# Altium schematic sheet DAC_OUT.SchDoc
size A3; Date: 2015/11/20; CompanyName: 成都淞幸科技有限责任公司; DrawnBy: 冯光荣; Engineer: 冯光荣; Organization: 系统集成部; Address1: 四川省成都市西航港街道珠江路; Address2: 空港国际城7栋1单元11层; DocumentNumber: SX-ZNJJ-02; Revision: v3.1; SheetNumber: 6; SheetTotal: 6; Telphone: 028-6445 2893; Fax: 028-8580 5757; Website: www.sunsheen.cn; DocumentName: DocumentName; ProjectName: ProjectName
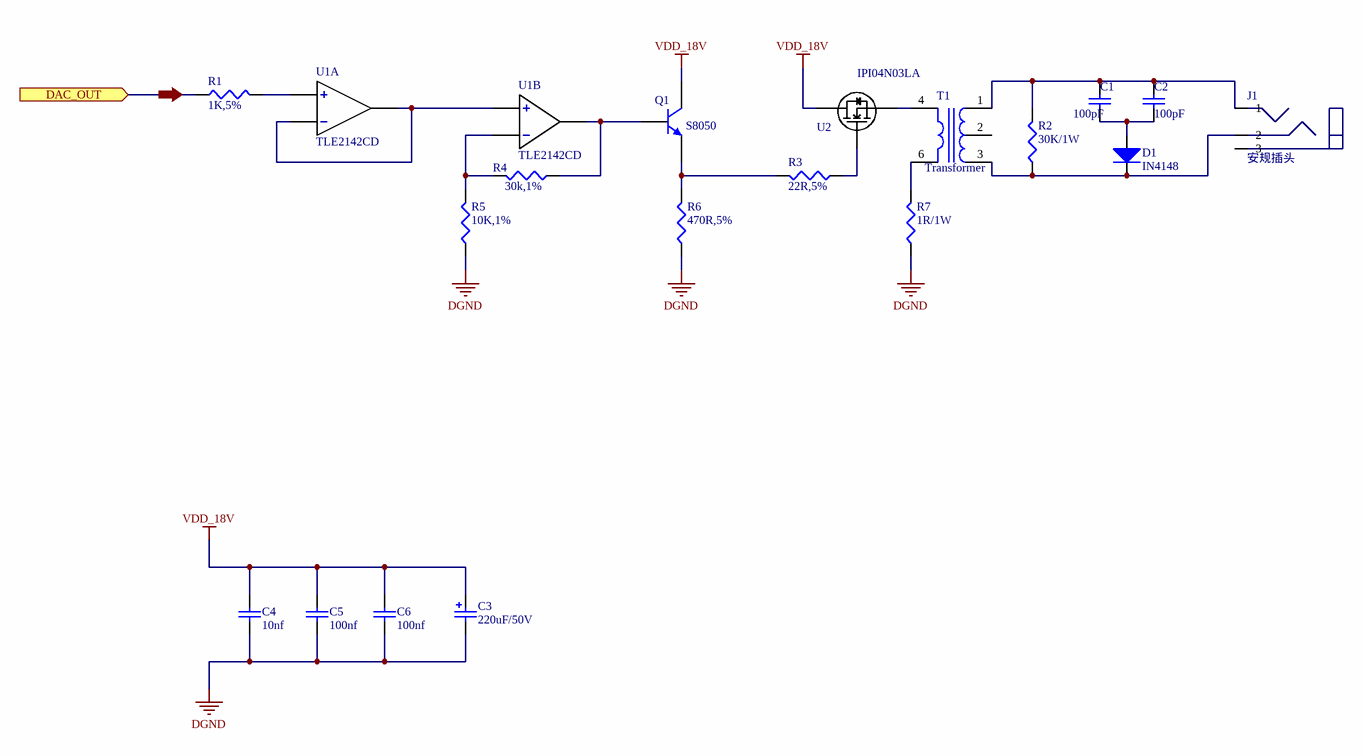
[diagram p0: DAC_OUT.SchDoc]

## Parts
C1  100pF  [Cap0603]
C2  100pF  [Cap0603]
C3  220uF/50V  [CapPol1_D12]
C4  10nf  [Cap0603]
C5  100nf  [Cap0603]
C6  100nf  [Cap0603]
D1  IN4148  [DIOMELF2513N]
J1  安规插头  [安规插头]
Q1  S8050  [SOT-23B]
R1  1K,5%  [Res0603]
R2  30K/1W  [Res_Power_5.0_4.0]
R3  22R,5%  [Res0603]
R4  30k,1%  [Res0603]
R5  10K,1%  [Res0603]
R6  470R,5%  [Res0603]
R7  1R/1W  [Res_Power_5.0_4.0]
T1  Transformer  [Transformer_19_19]
U1  TLE2142CD  [SOIC127P600X175-8N]  (parts A,B of 2)
U2  IPI04N03LA  [TO228P1003X238-3N]

## Ports
DAC_OUT (in)

## Nets
DGND: C3.2 C4.1 C5.1 C6.1 R5.1 R6.1 R7.1 U1.4(VCC-)
VDD_18V: C3.1 C4.2 C5.2 C6.2 Q1.3(C) U1.8(VCC+) U2.2(D)
DAC_OUT: R1.1 ; port DAC_OUT
NetC1_1: C1.1 C2.1 D1.A
NetC1_2: C1.2 C2.2 J1.1 R2.2 T1.1
NetD1_C: D1.C J1.2 R2.1 T1.3
NetQ1_1: Q1.1(B) R4.1 U1.7(OUT2)
NetQ1_2: Q1.2(E) R3.2 R6.2
NetR1_2: R1.2 U1.3(IN1+)
NetR3_1: R3.1 U2.1(G)
NetR4_2: R4.2 R5.2 U1.6(IN2-)
NetR7_2: R7.2 T1.6
NetT1_4: T1.4 U2.3(S)
NetU1_1: U1.1(OUT1) U1.2(IN1-) U1.5(IN2+)

Not connected (* = marked no-connect by the designer): J1 3; T1 2

## Notes on the sheet
- 签  名
- 底图总号
- 旧底图总号
- 媒体编号
- 日 期
- 批  准
- 审  核
- 校  对
- 设  计
- 标记
- 数量
- 文件编号：
- 更改单号
- 日  期
- 网址：
- 电话：
- 地址：
- 传真：
- 第
- 版  本
- 页
- 共
- A3
- 工程师

## Library data of the parts
C1 C2 C4-C6 = Cap Semi: 无极性电容（表贴）
C3 = Cap Pol1: 极性电容（径向）
D1 = Dio_IN4148
Q1 = S8050: NPN
R1 R3-R6 = Res: 电阻
R2 R7 = Res: 功率电阻
T1 = Transformer: 变压器
U1 = TLE2142CD: 运放
U2 = IPI04N03LA: N沟道MOS管